# EAGLE design SFXboard (EAGLE 6.2)
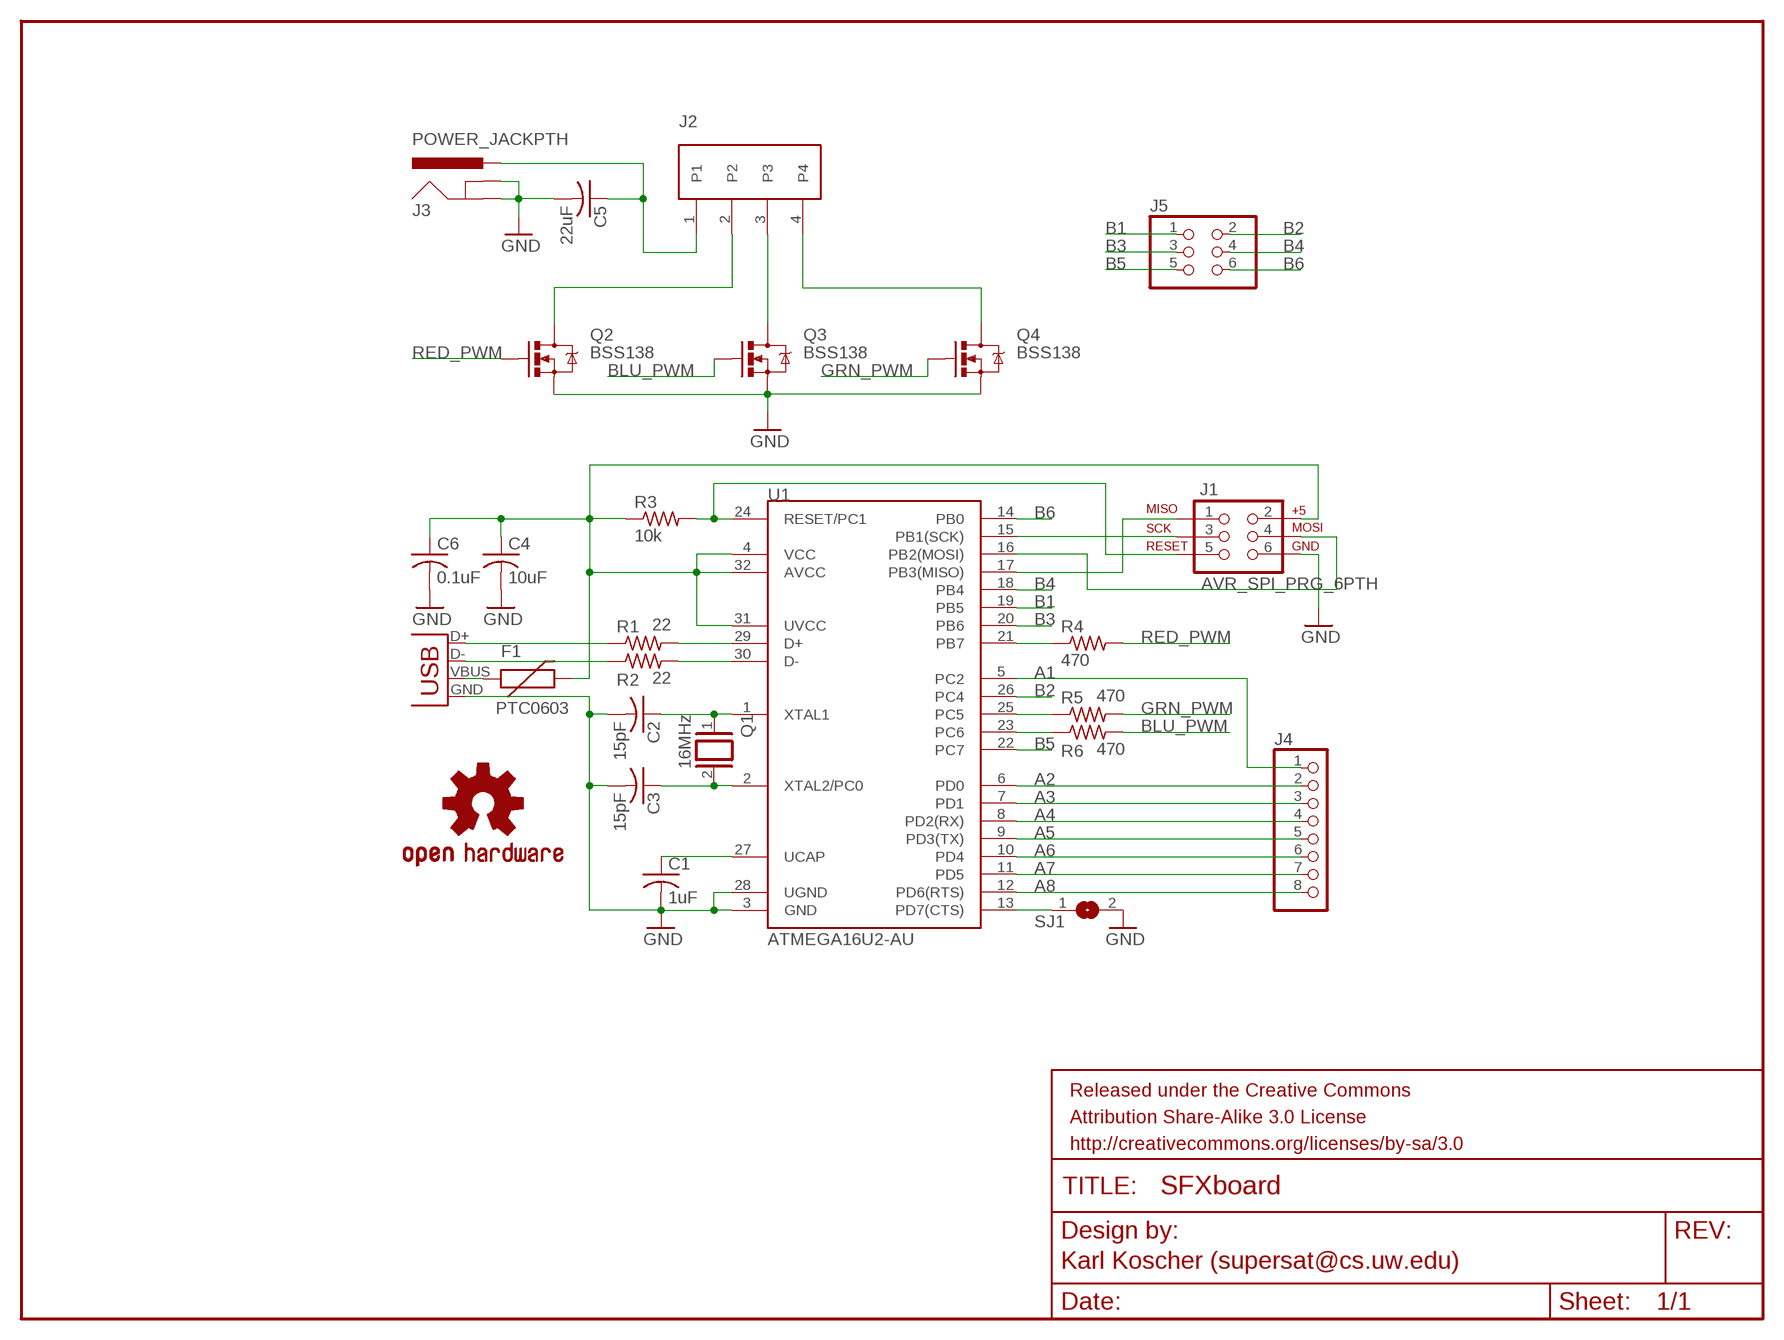
[diagram p0: schematic, sheet 1]

## Parts
C1  1uF  C-USC0603  [C0603]
C2  15pF  C-USC0603  [C0603]
C3  15pF  C-USC0603  [C0603]
C4  10uF  C-USC0805  [C0805]
C5  22uF  C-USC0805  [C0805]
C6  0.1uF  C-USC0402  [C0402]
F1  PTC0603  [0603]
FRAME1  FRAME-LETTER  [CREATIVE_COMMONS]
J1  AVR_SPI_PRG_6PTH  [2X3]
J2  TERMBLOCK4POS  [TERMBLOCK4P]
J3  POWER_JACKPTH  [POWER_JACK_PTH]
J4  PINHD-1X8  [1X08]
J5  PINHD-2X3  [2X03]
Q1  16MHz  XTAL/S  [QS]
Q2  BSS138  BSS138TRANS-00830  [SOT23-3]
Q3  BSS138  BSS138TRANS-00830  [SOT23-3]
Q4  BSS138  BSS138TRANS-00830  [SOT23-3]
R1  22  R-US_R0603  [R0603]
R2  22  R-US_R0603  [R0603]
R3  10k  R-US_R0603  [R0603]
R4  470  R-US_R0603  [R0603]
R5  470  R-US_R0603  [R0603]
R6  470  R-US_R0603  [R0603]
SJ1  SJ  [SJ]
U1  ATMEGA16U2-AU  ATMEGA8U2AU  [TQFP32-08]
U$2  OSHW-LOGOS  [OSHW-LOGO-S]
X1  USBSMD  [USB-MINIB]

## Nets
A1: J4.1 U1.5(PC2)
A2: J4.2 U1.6(PD0)
A3: J4.3 U1.7(PD1)
A4: J4.4 U1.8(PD2(RX))
A5: J4.5 U1.9(PD3(TX))
A6: J4.6 U1.10(PD4)
A7: J4.7 U1.11(PD5)
A8: J4.8 U1.12(PD6(RTS))
B: R6.1 U1.23(PC6)
B1: J5.1 U1.19(PB5)
B2: J5.2 U1.26(PC4)
B3: J5.3 U1.20(PB6)
B4: J5.4 U1.18(PB4)
B5: J5.5 U1.22(PC7)
B6: J5.6 U1.14(PB0)
BLU_PWM: Q3.1(G) R6.2
G: R5.1 U1.25(PC5)
GND: C1.2 C2.2 C3.2 C4.2 C5.2 C6.2 J1.6 J3.GND J3.GNDBREAK Q2.2(S) Q3.2(S) Q4.2(S) SJ1.2 U1.3(GND) U1.28(UGND) X1.GND
GRN_PWM: Q4.1(G) R5.2
N$1: C1.1 U1.27(UCAP)
N$2: F1.1 X1.VBUS
N$3: R1.1 X1.D+
N$4: R2.1 X1.D-
N$5: R1.2 U1.29(D+)
N$6: R2.2 U1.30(D-)
N$7: J1.5 R3.2 U1.24(RESET/PC1)
N$8: C2.1 Q1.1 U1.1(XTAL1)
N$9: C3.1 Q1.2 U1.2(XTAL2/PC0)
N$10: J2.2 Q2.3(D)
N$11: J1.3 U1.15(PB1(SCK))
N$12: J1.1 U1.17(PB3(MISO))
N$13: J1.4 U1.16(PB2(MOSI))
N$14: J2.3 Q3.3(D)
N$15: J2.4 Q4.3(D)
N$16: C5.1 J2.1 J3.PWR
N$17: SJ1.1 U1.13(PD7(CTS))
N$18: C4.1 C6.1 F1.2 J1.2 R3.1 U1.4(VCC) U1.31(UVCC) U1.32(AVCC)
R: R4.1 U1.21(PB7)
RED_PWM: Q2.1(G) R4.2

## Notes on the sheet
- Karl Koscher (supersat@cs.uw.edu)

## Library data of the parts
C1-C6 = resistor:C-US: CAPACITOR, American symbol
F1 = SparkFun-PowerIC:PTC: Resettable Fuse PTC Resettable Fuse. Spark Fun Electronics SKU : COM-08357
FRAME1 = SparkFun-Aesthetics:FRAME-LETTER: Schematic Frame Standard 8.5x11 US Letter frame
J1 = SparkFun-Connectors:AVR_SPI_PRG_6: AVR ISP 6 Pin This is the reduced ISP connector for AVR programming. Common on Arduino. This footprint will take up less PCB space and can be used with a 10-pin to 6-pin adapter such as SKU: BOB-08508
J2 = sfxboard:TERMBLOCK4POS: 4 pin terminal block, 5.08mm spacing
J3 = SparkFun-Connectors:POWER_JACK: Power Jack This is the standard 5.5mm barrel jack for power. The PTH is the most common, proven, reliable, footprint. All others are experimental. The Slot footprint only works if the mill layer is transmitted to the PCB fab house so be warned. Spark Fun Electronics SKU : PRT-00119. Mating wall wart : TOL-00298 (and others)
J4 = pinhead:PINHD-1X8: PIN HEADER
J5 = SparkFun-Connectors:PINHD-2X3: PIN HEADER
Q1 = special:XTAL/S: CRYSTAL
Q2-Q4 = SparkFun-DiscreteSemi:BSS138: NMOSFET, Enh Mode 50V/6-ohm 200mA (SOT-23) TRANS-00830; PROD_ID: TRANS-00830
R1-R6 = resistor:R-US_: RESISTOR, American symbol
SJ1 = jumper:SJ: SMD solder JUMPER
U1 = SparkFun-DigitalIC:ATMEGA8U2: Atmel 32-pin 8-bit Microcontroller with 8/16/32K Bystes of ISP Flash and USB Controller. ATmega8U2, ATmega16U2, and ATmega32U2
U$2 = SparkFun-Aesthetics:OSHW-LOGO: Open Source Hardware Logo This logo indicates the piece of hardware it is found on incorporates a OSHW license and/or adheres to the definition of open source hardware found here: http://freedomdefined.org/OSHW
X1 = SparkFun-Connectors:USB: USB Connectors USB-B-PTH is fully proven SKU : PRT-00139 USB-miniB is fully proven SKU : PRT-00587 USB-A-PCB is untested. USB-A-H is throughly reviewed, but untested. Spark Fun Electronics SKU : PRT-00437 USB-B-SMT is throughly reviewed, but untested. Needs silkscreen touching up. USB-A-S has not been used/tested USB-MB-H has not been used/tested

## Board
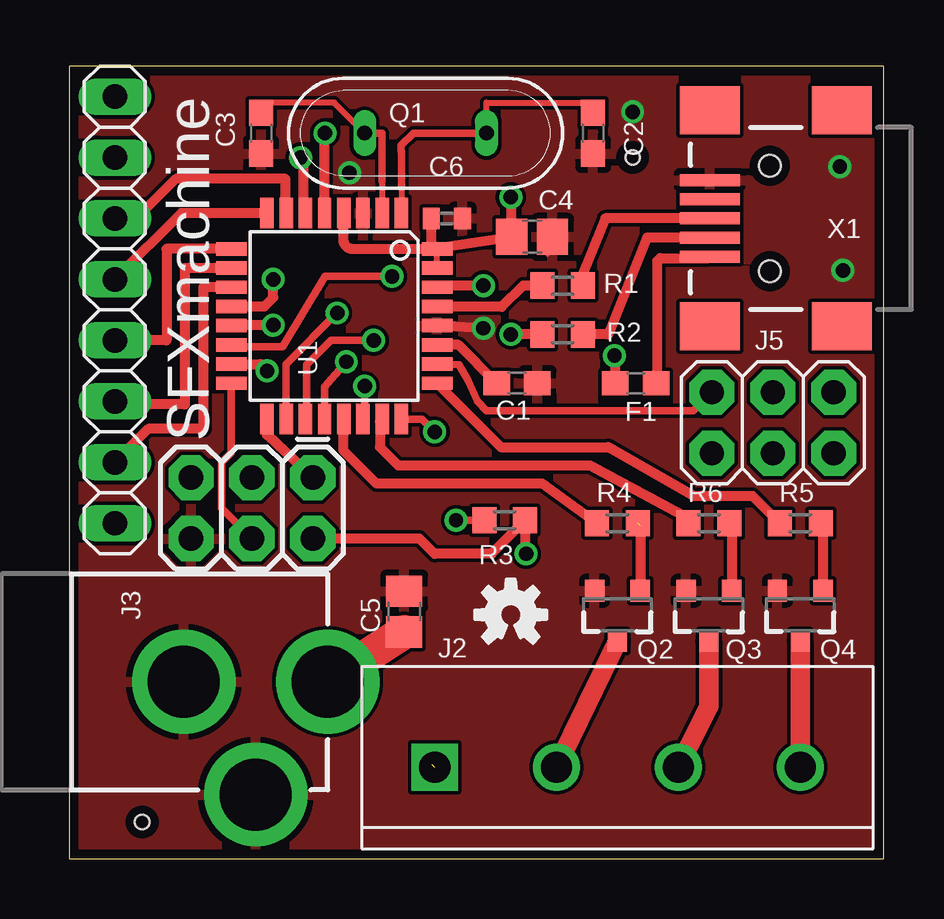
[diagram p1: board, top side]
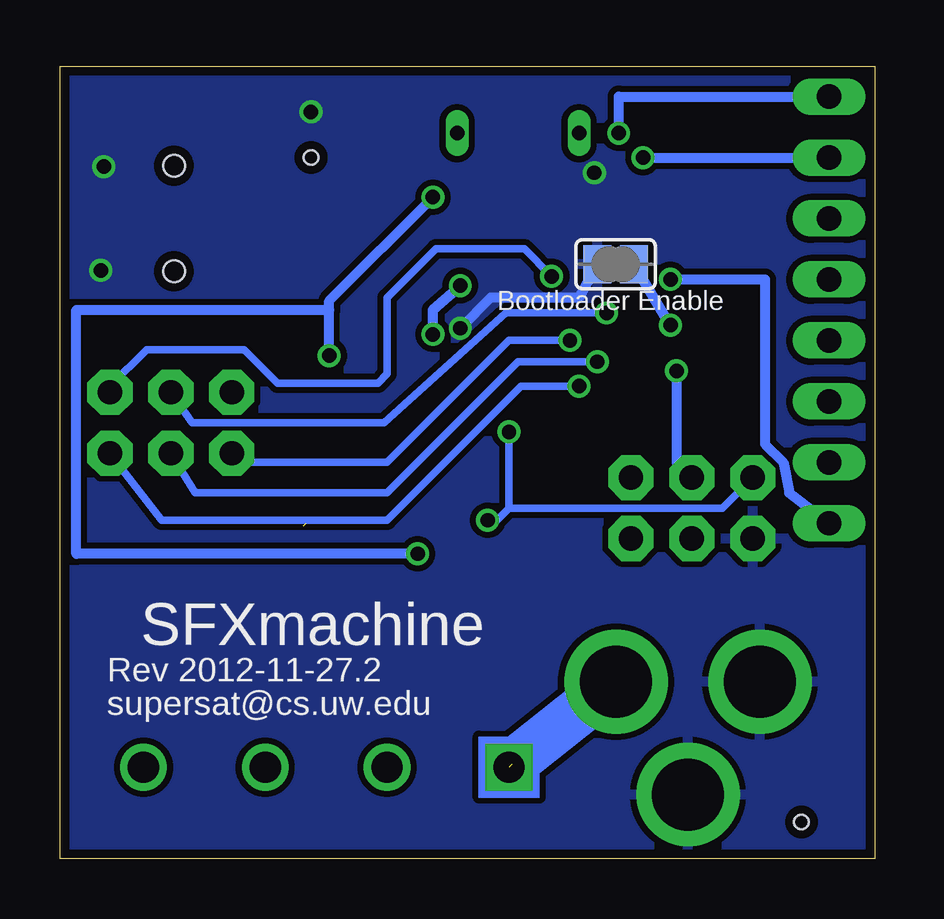
[diagram p2: board, bottom side, seen from below]

Size 33.96 x 33.01 mm. Coordinates in mm from the lower left corner, seen from the top.
Outline: 0,0 33.96,0 33.96,33.01 0,33.01 0,0
Copper layers (1*16): Top 0.0356mm / dielectric 1.5011mm / Bottom 0.0356mm
Design rules: minimum track width 6mil, minimum drill 13mil, track to track 6mil, track to pad 6mil, pad to pad 6mil, via to via 6mil, smd to smd 6mil, copper to edge 15mil, drill to drill 6mil, minimum pad ring 7mil, minimum via ring 7mil, stop-mask expansion 4mil, vias tented up to drill 25mil, thermal gap 10mil
Holes 0.6 mm at 23.5,29.21 3.05,1.52

### Footprints (pad centres in the part's own frame; a part is rotated, then mirrored left to right if it is on the bottom)
C0603 = smd 1.1 x 1: 1 -0.85,0; 2 0.85,0
C0805 = smd 1.3 x 1.5: 1 -0.85,0; 2 0.85,0
C0402 = smd 0.7 x 0.9: 1 -0.65,0; 2 0.65,0
0603 = smd 1.1 x 1: 1 -0.85,0; 2 0.85,0
2X3 = drill 1.016 pad 1.88 octagon: 1 0,0; 2 0,2.54; 3 2.54,0; 4 2.54,2.54; 5 5.08,0; 6 5.08,2.54
TERMBLOCK4P = drill 1.3 square: 1 -7.62,0 | drill 1.3: 2 -2.54,0; 3 2.54,0; 4 7.62,0
POWER_JACK_PTH = drill 2.997 pad 4.318: GND 0,7.7; GNDBREAK 4.7,10.7; PWR 0,13.7
1X08 = drill 1.016 long: 1 -8.89,0; 2 -6.35,0; 3 -3.81,0; 4 -1.27,0; 5 1.27,0; 6 3.81,0; 7 6.35,0; 8 8.89,0
2X03 = drill 1.016 pad 1.88 octagon: 1 -2.54,-1.27; 2 -2.54,1.27; 3 0,-1.27; 4 0,1.27; 5 2.54,-1.27; 6 2.54,1.27
QS = drill 0.61 long: 1 -2.54,0; 2 2.54,0
SOT23-3 = smd 0.8 x 0.9: 1 -0.95,-1; 2 0.95,-1; 3 0,1.1
R0603 = smd 1 x 1.1: 1 -0.85,0; 2 0.85,0
SJ = smd 1.168 x 1.6: 1 -0.762,0; 2 0.762,0
TQFP32-08 = smd 1.27 x 0.559: 1 -4.293,2.8; 2 -4.293,2; 3 -4.293,1.2; 4 -4.293,0.4; 5 -4.293,-0.4; 6 -4.293,-1.2; 7 -4.293,-2; 8 -4.293,-2.8; 17 4.293,-2.8; 18 4.293,-2; 19 4.293,-1.2; 20 4.293,-0.4; 21 4.293,0.4; 22 4.293,1.2; 23 4.293,2; 24 4.293,2.8 | smd 0.559 x 1.27: 9 -2.8,-4.293; 10 -2,-4.293; 11 -1.2,-4.293; 12 -0.4,-4.293; 13 0.4,-4.293; 14 1.2,-4.293; 15 2,-4.293; 16 2.8,-4.293; 25 2.8,4.293; 26 2,4.293; 27 1.2,4.293; 28 0.4,4.293; 29 -0.4,4.293; 30 -1.2,4.293; 31 -2,4.293; 32 -2.8,4.293
USB-MINIB = smd 2.5 x 0.5: D+ 2.5,0; D- 2.5,0.8; GND 2.5,-1.6; ID 2.5,-0.8; VBUS 2.5,1.6 | smd 2.5 x 2: MTN1 -3,4.5; MTN2 2.5,4.5; MTN3 -3,-4.5; MTN4 2.5,-4.5 | hole 0.9: 0,2.2; 0,-2.2

### Placement (x,y rotation side)
C1  18.67,19.81 0 top
C2  21.84,30.23 270 top
C3  8,30.23 270 top
C4  19.3,25.91 0 top
C5  13.97,10.29 90 top
C6  15.75,26.67 0 top
F1  23.62,19.81 180 top
FRAME1  20.32,-12.7 0 top  (outside the outline)
J1  10.16,15.88 180 top
J2  22.86,3.81 0 top
J3  -2.92,7.37 270 top
J4  1.91,22.86 270 top
J5  29.34,18.16 0 top
Q1  14.86,30.23 180 top
Q2  22.86,10.16 180 top
Q3  26.67,10.16 180 top
Q4  30.48,10.16 180 top
R1  20.57,23.88 180 top
R2  20.57,21.84 180 top
R3  18.16,14.1 180 top
R4  22.86,13.97 0 top
R5  30.48,13.97 0 top
R6  26.67,13.97 0 top
SJ1  10.79,24.77 180 bottom
U1  11.05,22.61 270 top
U$2  18.41,10.16 0 top
X1  29.21,26.67 180 top

### Tracks (layer width: path | path; a pad name or v marks a point on that pad's centre or on a via)
A1  (via drill 0.6)
  Top 0.406: U1.5 10.65,29.97 v10.67,30.23
  Bottom 0.406: J4.1 10.67,31.75 v10.67,30.23
A2  (via drill 0.6)
  Top 0.406: U1.6 9.78,26.97 9.78,29.21 v9.65,29.21
  Bottom 0.406: v9.65,29.21 J4.2
A3
  Top 0.406: U1.7 9.02,26.93 9.02,28.32 4.45,28.32 2.79,26.67 J4.3
A4
  Top 0.406: U1.8 4.67,26.9 J4.4
A5
  Top 0.406: U1.9 4.06,25.41 4.06,21.59 J4.5
A6
  Top 0.406: U1.10 4.83,24.61 4.83,18.92 1.91,18.92 J4.6
A7
  Top 0.406: U1.11 5.59,23.81 5.59,17.91 3.3,17.91 J4.7
A8  (via drill 0.6)
  Top 0.406: U1.12 8.15,23.01 8.51,23.37 v8.51,24.13
  Bottom 0.406: v8.51,24.13 4.57,24.13 4.57,17.27 3.81,16.51 3.56,15.24 J4.8
B
  Top 0.406: U1.23 12.95,18.22 12.95,17.14 13.72,16.38 21.72,16.38 25.82,14.19 R6.1
B1  (via drill 0.6)
  Top 0.305: v12.7,21.59 10.92,21.59 9.91,20.57 9.91,18.37 U1.19
  Bottom 0.305: v12.7,21.59 15.24,21.59 20.32,16.51 26.42,16.51 J5.1
B2
  Top 0.305: U1.26 16.26,20.57 16.64,19.94 17.02,19.05 17.4,18.67 26.04,18.67 J5.2
B3  (via drill 0.6)
  Top 0.305: U1.20 10.65,19.67 v11.56,20.7
  Bottom 0.305: v11.56,20.7 14.86,20.7 20.32,15.24 28.32,15.24 J5.3
B4  (via drill 0.6)
  Top 0.305: U1.18 9.05,20.61 v11.18,22.73
  Bottom 0.305: v11.18,22.73 15.37,22.73 20.45,18.16 28.45,18.16 J5.4
B5  (via drill 0.6)
  Top 0.305: U1.22 12.32,18.38 v12.32,19.68
  Bottom 0.305: v12.32,19.68 14.73,19.68 20.32,14.1 29.72,14.1 J5.5
B6  (via drill 0.6)
  Top 0.305: U1.14 6.83,21.34 8.89,21.34 10.67,24.26 v13.46,24.26
  Bottom 0.305: J5.6 31.88,19.68 30.35,21.21 26.29,21.21 24.89,19.81 20.7,19.81 20.32,20.19 20.32,23.37 18.29,25.4 14.61,25.4 v13.46,24.26
BLU_PWM
  Top 0.406: R6.2 27.62,13.87 Q3.1
G
  Top 0.406: U1.25 18,17.14 22.48,17.14 26.04,15.11 28.49,15.11 R5.1
GND  (via drill 0.6)
  Top 0.152: 19.94,25.15 C4.2
  Top 0.406: v17.27,22.1 U1.28
  Bottom 0.406: SJ1.2 12.32,23.37 16,23.37 v17.27,22.1
  other vias: 11.68,28.57 23.5,31.11 32.13,28.83 32.26,24.51
  pour Bottom (isolate 0.254): 0,33.02 34.29,33.02 34.29,0 0,0
  pour Top: 0,33.02 34.29,33.02 34.29,0 0,0
GRN_PWM
  Top 0.406: R5.2 31.43,13.87 Q4.1
N$1
  Top 0.254: 14.86,21.34 U1.27
  Top 0.406: C1.1 16.23,21.41 U1.27
N$2
  Top 0.406: F1.1 24.51,19.85 24.51,24.89 24.64,25.02 26.66,25.02 X1.VBUS
N$3
  Top 0.406: X1.D+ 22.35,26.67 21.21,23.88 R1.1
N$4
  Top 0.406: X1.D- 24.09,25.87 22.48,21.84 R2.1
N$5
  Top 0.406: R1.2 18.92,23.88 18.03,22.99 15.36,22.99 U1.29
N$6  (via drill 0.6)
  Top 0.254: 14.86,23.88 U1.30
  Top 0.406: R2.2 v18.41,21.84 | v17.27,23.88 15.41,23.88 U1.30
  Bottom 0.406: v18.41,21.84 18.41,22.86 v17.27,23.88
N$7  (via drill 0.6)
  Top 0.305: U1.24 14.71,18.31 v15.24,17.78 | R3.2 v16.13,14.1
  Bottom 0.305: v15.24,17.78 15.24,14.61 | 15.24,14.61 6.35,14.61 J1.5 | v16.13,14.1 15.75,14.1 15.24,14.61
N$8
  Top 0.254: Q1.1 17.4,31.5 21.84,31.5 C2.1 | 13.85,27.95 U1.1
  Top 0.305: 13.85,27.95 13.85,29.46 13.84,29.46 13.84,29.72 14.35,30.23 Q1.1
N$9
  Top 0.254: Q1.2 11.05,31.5 8,31.5 C3.1 | 13.05,28.23 U1.2
  Top 0.305: 13.05,28.23 13.05,30.23 Q1.2
N$10
  Top 0.813: Q2.3 J2.2
N$11  (via drill 0.6)
  Top 0.406: U1.15 7.97,20.61 v8.26,20.32
  Bottom 0.406: v8.26,20.32 8.26,16.51 J1.3
N$12
  Top 0.406: U1.17 8.25,17.66 J1.1
N$13
  Top 0.305: U1.16 6.76,16.92 6.35,16.51 6.35,14.61 J1.4
N$14
  Top 0.813: Q3.3 26.67,6.35 J2.3
N$15
  Top 0.813: Q4.3 J2.4
N$16  (1 unrouted)
  Top 1.422: C5.1 J3.PWR
  Bottom 2.032: 15.11,3.92 J3.PWR
N$17  (via drill 0.6)
  Top 0.406: v8.51,22.23 6.78,22.23 U1.13
  Bottom 0.406: v8.51,22.23 SJ1.1
N$18  (via drill 0.6)
  Top 0.254: U1.31 U1.32 15.09,25.4 | 18.67,26 C4.1
  Top 0.406: C6.1 15.1,25.65 U1.32 11.8,25.41 arc-90 11.43,25.78 11.43,26.88 arc-90 U1.4 | F1.2 22.77,20.92 v22.73,20.95 | v18.41,27.56 18.41,25.95 C4.1 15.09,25.4 | J1.2 14.61,13.34 15.24,12.7 17.61,12.7 R3.1 19.01,12.7 v19.05,12.7
  Bottom 0.406: v22.73,20.95 22.73,22.86 | 22.73,22.86 22.73,23.24 v18.41,27.56 | v19.05,12.7 33.27,12.7 33.27,22.86 22.73,22.86
R
  Top 0.406: R4.1 19.72,15.62 12.83,15.62 11.43,17.02 11.43,18.29 U1.21
RED_PWM  (1 unrouted)
  Top 0.152: 24.13,11.43 Q2.1
  Top 0.406: 23.81,13.87 Q2.1
(copper drawn outside any net)
  shapes: Bottom area x1

### Text on the board
tPlace: SFXmachine
bPlace: SFXmachine | Rev 2012-11-27.2 | supersat@cs.uw.edu
bNames: Bootloader Enable